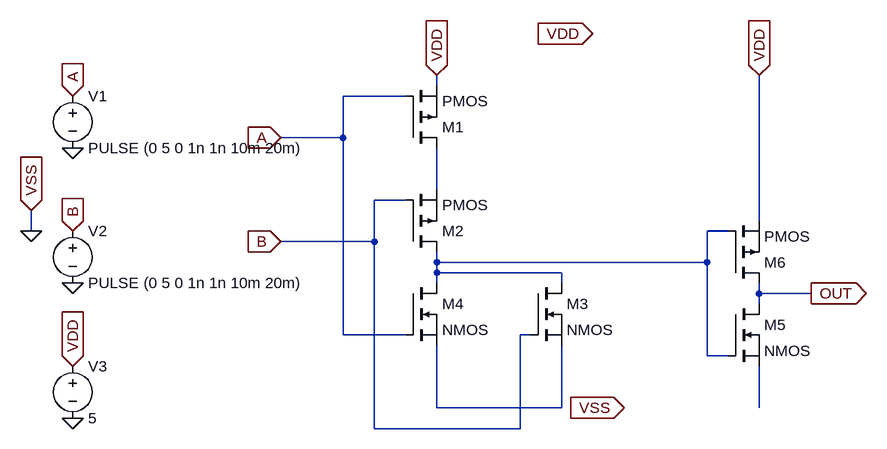
[diagram p0: schematic Draft1.asc]
Draft1.asc, the LTspice schematic file:
Version 4.1
SHEET 1 880 680
WIRE 0 -80 0 -96
WIRE -48 -64 -144 -64
WIRE -144 0 -144 -64
WIRE -144 0 -240 0
WIRE 0 80 0 16
WIRE -48 96 -96 96
WIRE 496 128 496 -96
WIRE -624 144 -624 112
WIRE 448 144 416 144
WIRE -96 160 -96 96
WIRE -96 160 -240 160
WIRE 0 192 0 176
WIRE 416 192 416 144
WIRE 416 192 0 192
WIRE 0 208 0 192
WIRE 192 208 0 208
WIRE 0 224 0 208
WIRE 192 224 192 208
WIRE 496 240 496 224
WIRE 576 240 496 240
WIRE 496 256 496 240
WIRE -144 304 -144 0
WIRE -48 304 -144 304
WIRE 144 304 128 304
WIRE 416 336 416 192
WIRE 448 336 416 336
WIRE 0 416 0 320
WIRE 192 416 192 320
WIRE 192 416 0 416
WIRE 496 416 496 352
WIRE -96 448 -96 160
WIRE 128 448 128 304
WIRE 128 448 -96 448
FLAG -240 0 A
IOPIN -240 0 In
FLAG -240 160 B
IOPIN -240 160 In
FLAG 240 -160 VDD
IOPIN 240 -160 In
FLAG 288 416 VSS
IOPIN 288 416 In
FLAG 576 240 OUT
IOPIN 576 240 Out
FLAG 0 -96 VDD
IOPIN 0 -96 In
FLAG 496 -96 VDD
IOPIN 496 -96 In
FLAG -560 352 VDD
IOPIN -560 352 In
FLAG -560 432 0
FLAG -560 224 0
FLAG -560 16 0
FLAG -624 144 0
FLAG -624 112 VSS
IOPIN -624 112 In
FLAG -560 -64 A
IOPIN -560 -64 In
FLAG -560 144 B
IOPIN -560 144 In
SYMBOL pmos -48 16 M180
SYMATTR InstName M1
SYMBOL pmos -48 176 M180
SYMATTR InstName M2
SYMBOL nmos 144 224 R0
SYMATTR InstName M3
SYMBOL nmos -48 224 R0
SYMATTR InstName M4
SYMBOL nmos 448 256 R0
SYMATTR InstName M5
SYMBOL pmos 448 224 M180
SYMATTR InstName M6
SYMBOL voltage -560 -80 R0
SYMATTR InstName V1
SYMATTR Value PULSE (0 5 0 1n 1n 10m 20m)
SYMBOL voltage -560 128 R0
SYMATTR InstName V2
SYMATTR Value PULSE (0 5 0 1n 1n 10m 20m)
SYMBOL voltage -560 336 R0
SYMATTR InstName V3
SYMATTR Value 5

The netlist it stands for:
* Draft1.asc
M1 N001 A VDD VDD PMOS
M2 N002 B N001 N001 PMOS
M3 N002 B N003 N003 NMOS
M4 N002 A N003 N003 NMOS
M5 OUT N002 N004 N004 NMOS
M6 OUT N002 VDD VDD PMOS
V1 A 0 PULSE (0 5 0 1n 1n 10m 20m)
V2 B 0 PULSE (0 5 0 1n 1n 10m 20m)
V3 VDD 0 5
.model NMOS NMOS
.model PMOS PMOS
.lib standard.mos
.backanno
.end